# EAGLE design wifiCPUnew (EAGLE 6.3)
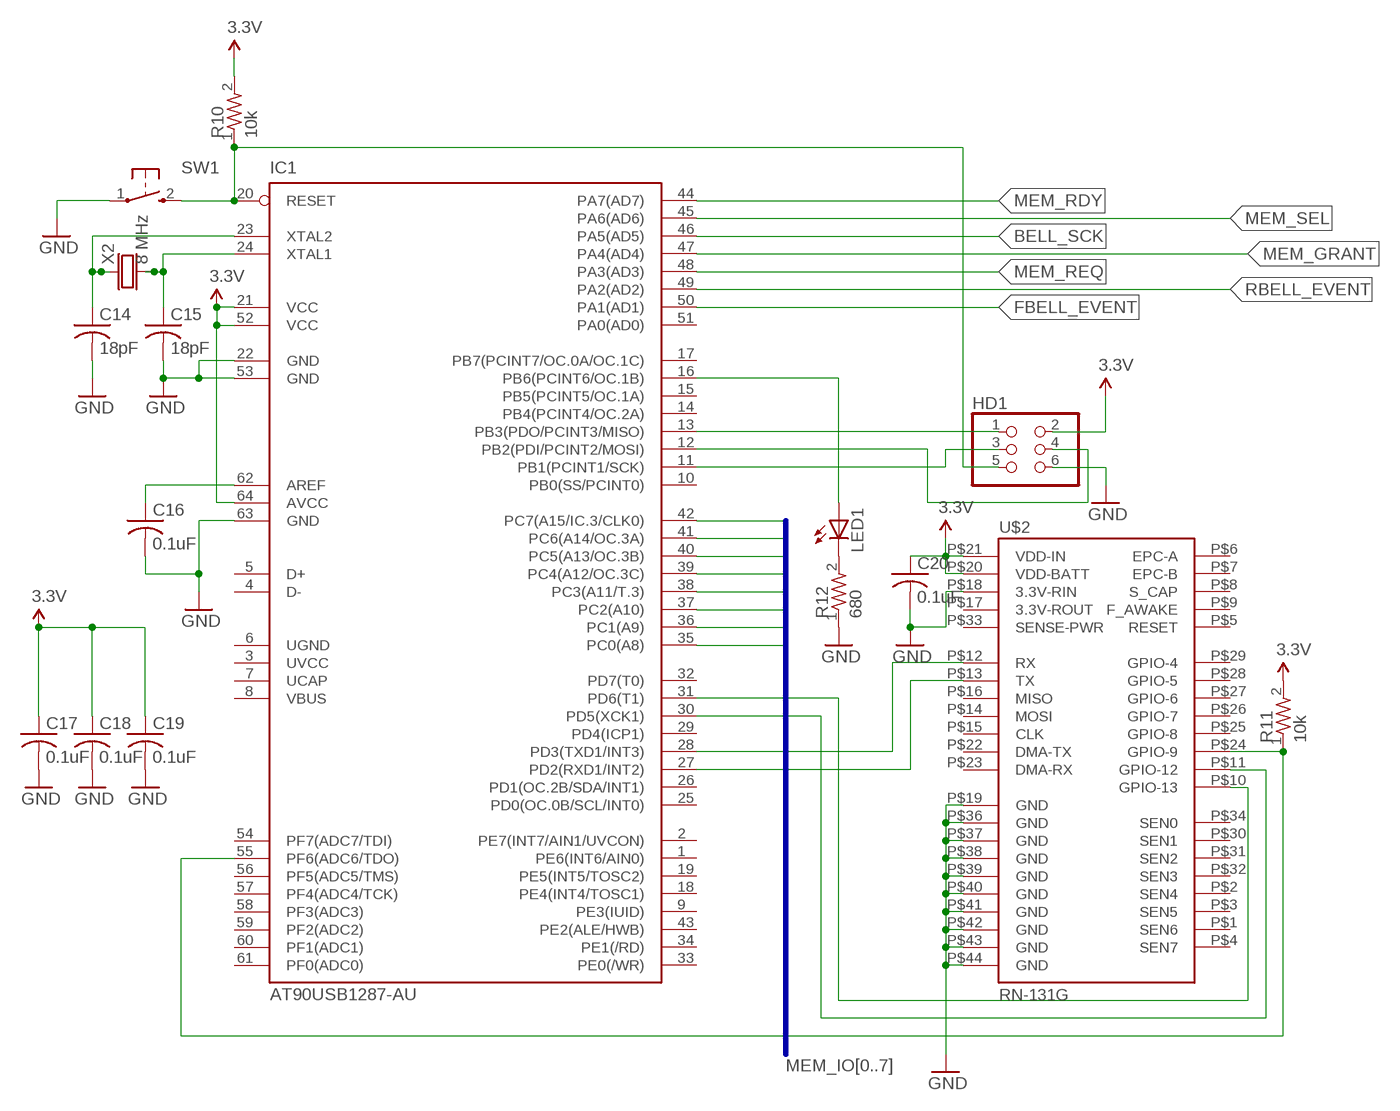
[diagram p0: schematic, sheet 1]

## Parts
C14  18pF  0603_CAP  [0603_RESISTOR]
C15  18pF  0603_CAP  [0603_RESISTOR]
C16  0.1uF  0603_CAP  [0603_RESISTOR]
C17  0.1uF  0603_CAP  [0603_RESISTOR]
C18  0.1uF  0603_CAP  [0603_RESISTOR]
C19  0.1uF  0603_CAP  [0603_RESISTOR]
C20  0.1uF  0603_CAP  [0603_RESISTOR]
HD1  HEADER2X3  [HEADER2X3]
IC1  AT90USB1287-AU  [TQFP64]
LED1  LEDCHIP-LED0603  [CHIP-LED0603]
R10  10k  0603_RESISTOR  [0603_RESISTOR]
R11  10k  0603_RESISTOR  [0603_RESISTOR]
R12  680  0603_RESISTOR  [0603_RESISTOR]
SW1  TAC-SWITCH  [TAC-SWITCH]
U$2  RN-131G  [RN-131G]
X2  8 MHz  CRYSTAL_5X3  [CRYSTAL_5X3]

## Nets
3.3V: C17.1 C18.1 C19.1 C20.1 HD1.2 IC1.21(VCC) IC1.52(VCC) IC1.64(AVCC) R10.2 R11.2 U$2.P$20(VDD-BATT) U$2.P$21(VDD-IN)
BELL_SCK: IC1.46(PA5(AD5))
FBELL_EVENT: IC1.50(PA1(AD1))
GND: C14.2 C15.2 C16.2 C17.2 C18.2 C19.2 C20.2 HD1.6 IC1.22(GND) IC1.53(GND) IC1.63(GND) R12.1 SW1.1 U$2.P$18(3.3V-RIN) U$2.P$19(GND) U$2.P$36(GND) U$2.P$37(GND) U$2.P$38(GND) U$2.P$39(GND) U$2.P$40(GND) U$2.P$41(GND) U$2.P$42(GND) U$2.P$43(GND) U$2.P$44(GND)
MEM_GRANT: IC1.47(PA4(AD4))
MEM_IO0: IC1.35(PC0(A8))
MEM_IO1: IC1.36(PC1(A9))
MEM_IO2: IC1.37(PC2(A10))
MEM_IO3: IC1.38(PC3(A11/T.3))
MEM_IO4: IC1.39(PC4(A12/OC.3C))
MEM_IO5: IC1.40(PC5(A13/OC.3B))
MEM_IO6: IC1.41(PC6(A14/OC.3A))
MEM_IO7: IC1.42(PC7(A15/IC.3/CLK0))
MEM_RDY: IC1.44(PA7(AD7))
MEM_REQ: IC1.48(PA3(AD3))
MEM_SEL: IC1.45(PA6(AD6))
MISO: HD1.1 IC1.13(PB3(PDO/PCINT3/MISO))
MOSI: HD1.4 IC1.12(PB2(PDI/PCINT2/MOSI))
N$1: C14.1 IC1.23(XTAL2) X2.1
N$2: C15.1 IC1.24(XTAL1) X2.2
N$4: LED1.C R12.2
N$5: IC1.16(PB6(PCINT6/OC.1B)) LED1.A
N$6: IC1.28(PD3(TXD1/INT3)) U$2.P$12(RX)
N$8: C16.1 IC1.62(AREF)
N$9: IC1.27(PD2(RXD1/INT2)) U$2.P$13(TX)
N$10: IC1.31(PD6(T1)) U$2.P$10(GPIO-13)
N$11: IC1.30(PD5(XCK1)) U$2.P$11(GPIO-12)
N$13: IC1.55(PF6(ADC6/TDO)) R11.1 U$2.P$24(GPIO-9)
RBELL_EVENT: IC1.49(PA2(AD2))
SCK: HD1.3 IC1.11(PB1(PCINT1/SCK))
WIFI_RESET: HD1.5 IC1.20(RESET) R10.1 SW1.2
Unconnected: IC1.1(PE6(INT6/AIN0)) IC1.2(PE7(INT7/AIN1/UVCON)) IC1.4(D-) IC1.5(D+) IC1.9(PE3(IUID)) IC1.10(PB0(SS/PCINT0)) IC1.14(PB4(PCINT4/OC.2A)) IC1.15(PB5(PCINT5/OC.1A)) IC1.17(PB7(PCINT7/OC.0A/OC.1C)) IC1.18(PE4(INT4/TOSC1)) IC1.19(PE5(INT5/TOSC2)) IC1.25(PD0(OC.0B/SCL/INT0)) IC1.26(PD1(OC.2B/SDA/INT1)) IC1.29(PD4(ICP1)) IC1.32(PD7(T0)) IC1.33(PE0(/WR)) IC1.34(PE1(/RD)) IC1.43(PE2(ALE/HWB)) IC1.51(PA0(AD0)) IC1.54(PF7(ADC7/TDI)) IC1.56(PF5(ADC5/TMS)) IC1.57(PF4(ADC4/TCK)) IC1.58(PF3(ADC3)) IC1.59(PF2(ADC2)) IC1.60(PF1(ADC1)) IC1.61(PF0(ADC0)) U$2.P$1(SEN6) U$2.P$2(SEN4) U$2.P$3(SEN5) U$2.P$4(SEN7) U$2.P$5(RESET) U$2.P$6(EPC-A) U$2.P$7(EPC-B) U$2.P$8(S_CAP) U$2.P$9(F_AWAKE) U$2.P$14(MOSI) U$2.P$15(CLK) U$2.P$16(MISO) U$2.P$17(3.3V-ROUT) U$2.P$22(DMA-TX) U$2.P$23(DMA-RX) U$2.P$25(GPIO-8) U$2.P$26(GPIO-7) U$2.P$27(GPIO-6) U$2.P$28(GPIO-5) U$2.P$29(GPIO-4) U$2.P$30(SEN1) U$2.P$31(SEN2) U$2.P$32(SEN3) U$2.P$33(SENSE-PWR) U$2.P$34(SEN0)

## Buses
MEM_IO[0..7]

## Power pins joined to a net without a drawn wire
UCAP: IC1.7(UCAP)
UGND: IC1.6(UGND)
UVCC: IC1.3(UVCC)
VBUS: IC1.8(VBUS)

## Library data of the parts
C14-C20 = jkf-parts:0603_CAP: 0603 Capacitor
HD1 = jkf-parts:HEADER2X3
IC1 = at90usb:AT90USB1287-*: Atmel AT90USB1287 AVR Microcontroller with USB Interface and 128kB Flash Memory
LED1 = adafruit:LED: LED OSRAM: - CHIPLED LG R971, LG N971, LY N971, LG Q971, LY Q971, LO R971, LY R971 LH N974, LH R974 LS Q976, LO Q976, LY Q976 LO Q996 - Hyper CHIPLED LW Q18S LB Q993, LB Q99A, LB R99A - SideLED LS A670, LO A670, LY A670, LG A670, LP A670 LB A673, LV A673, LT A673, LW A673 LH A674 LY A675 LS A676, LA A676, LO A676, LY A676, LW A676 LS A679, LY A679, LG A679 - Hyper Micro SIDELED® LS Y876, LA Y876, LO Y876, LY Y876 LT Y87S - SmartLED LW L88C, LW L88S LB L89C, LB L89S, LG L890 LS L89K, LO L89K, LY L89K LS L896, LA L896, LO L896, LY L896 - TOPLED LS T670, LO T670, LY T670, LG T670, LP T670 LSG T670, LSP T670, LSY T670, LOP T670, LYG T670 LG T671, LOG T671, LSG T671 LB T673, LV T673, LT T673, LW T673 LH T674 LS T676, LA T676, LO T676, LY T676, LB T676, LH T676, LSB T676, LW T676 LB T67C, LV T67C, LT T67C, LS T67K, LO T67K, LY T67K, LW E67C LS E67B, LA E67B, LO E67B, LY E67B, LB E67C, LV E67C, LT E67C LW T67C LS T679, LY T679, LG T679 LS T770, LO T770, LY T770, LG T770, LP T770 LB T773, LV T773, LT T773, LW T773 LH T774 LS E675, LA E675, LY E675, LS T675 LS T776, LA T776, LO T776, LY T776, LB T776 LHGB T686 LT T68C, LB T68C - Hyper Mini TOPLED® LB M676 - Mini TOPLED Santana® LG M470 LS M47K, LO M47K, LY M47K Source: http://www.osram.convergy.de/
R10-R12 = jkf-parts:0603_RESISTOR
SW1 = jkf-parts:TAC-SWITCH
U$2 = SparkFun-RF:RN-131G: Roving Netowrks WiFLy GSX Module
X2 = jkf-parts:CRYSTAL_5X3: Crystal 5mm x 3mm

## Board
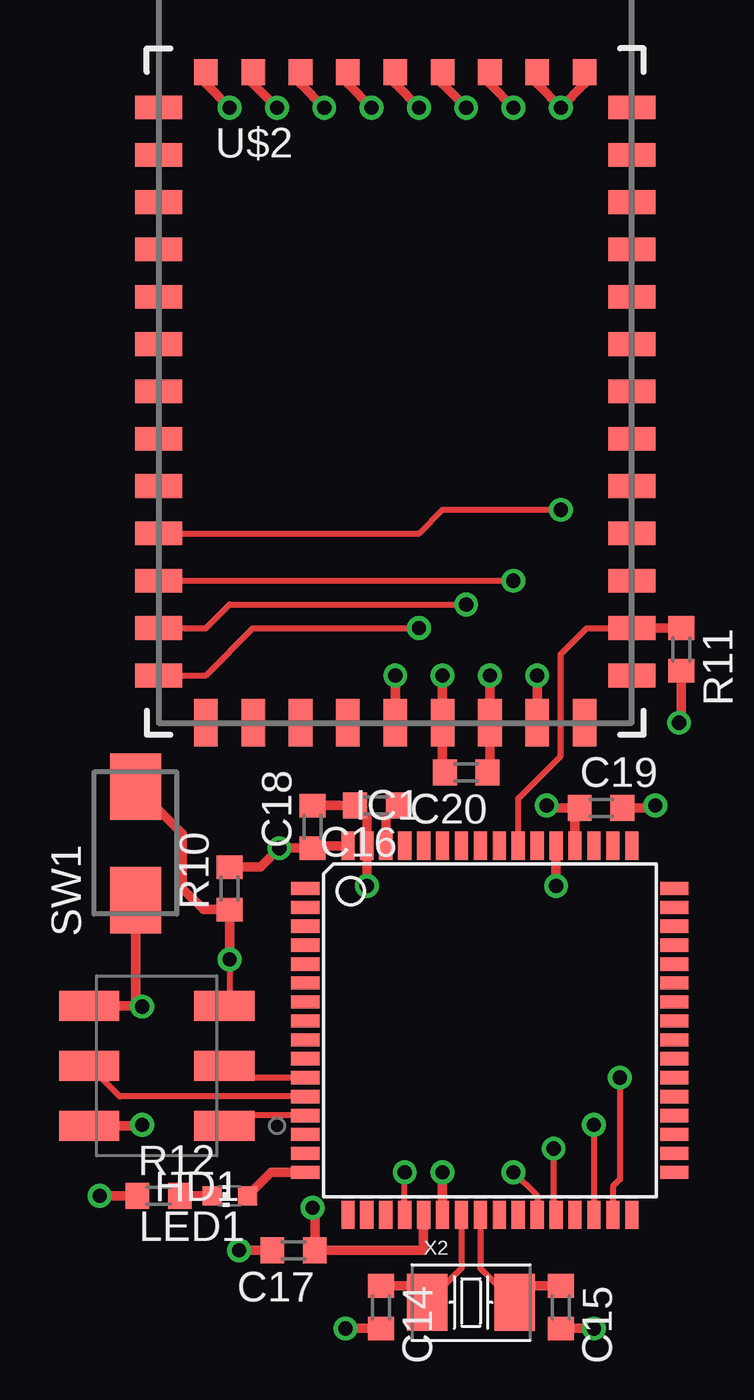
[diagram p1: board, top side]
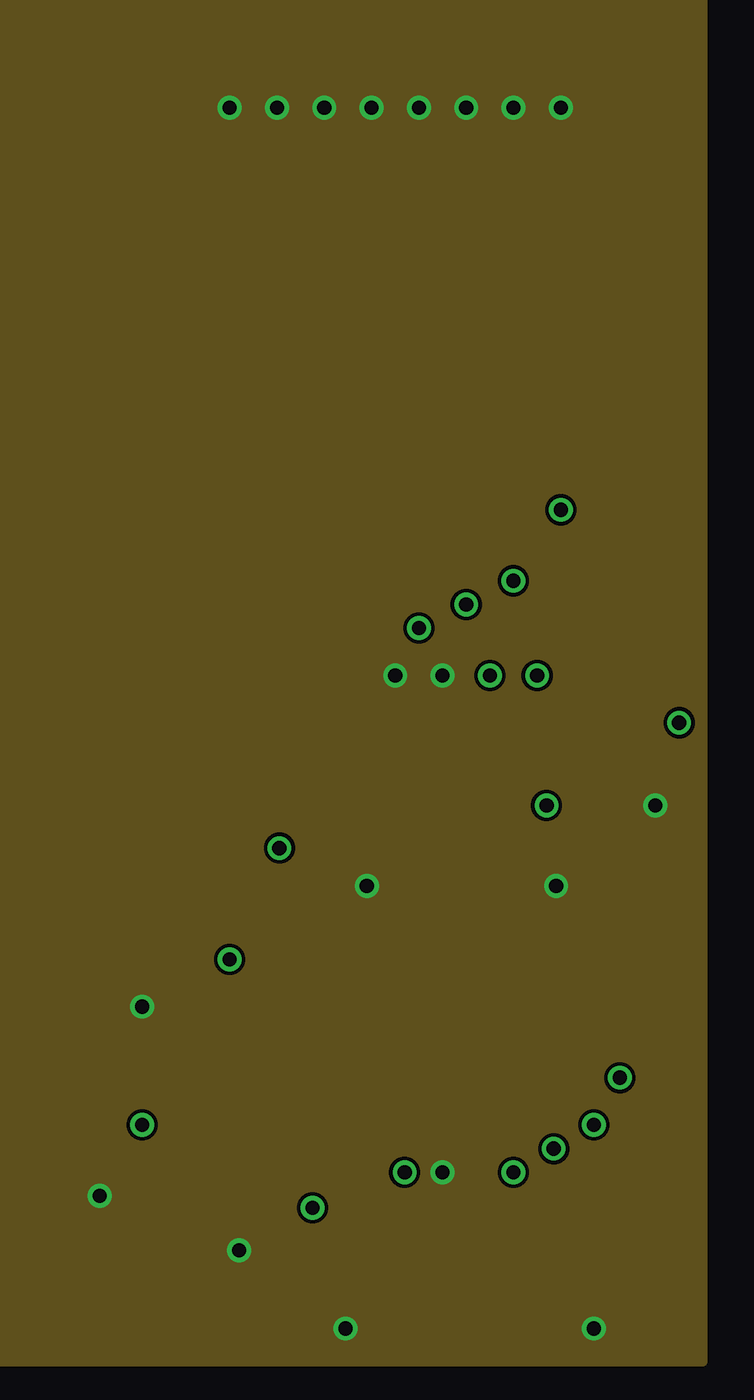
[diagram p2: board, inner layer GND]
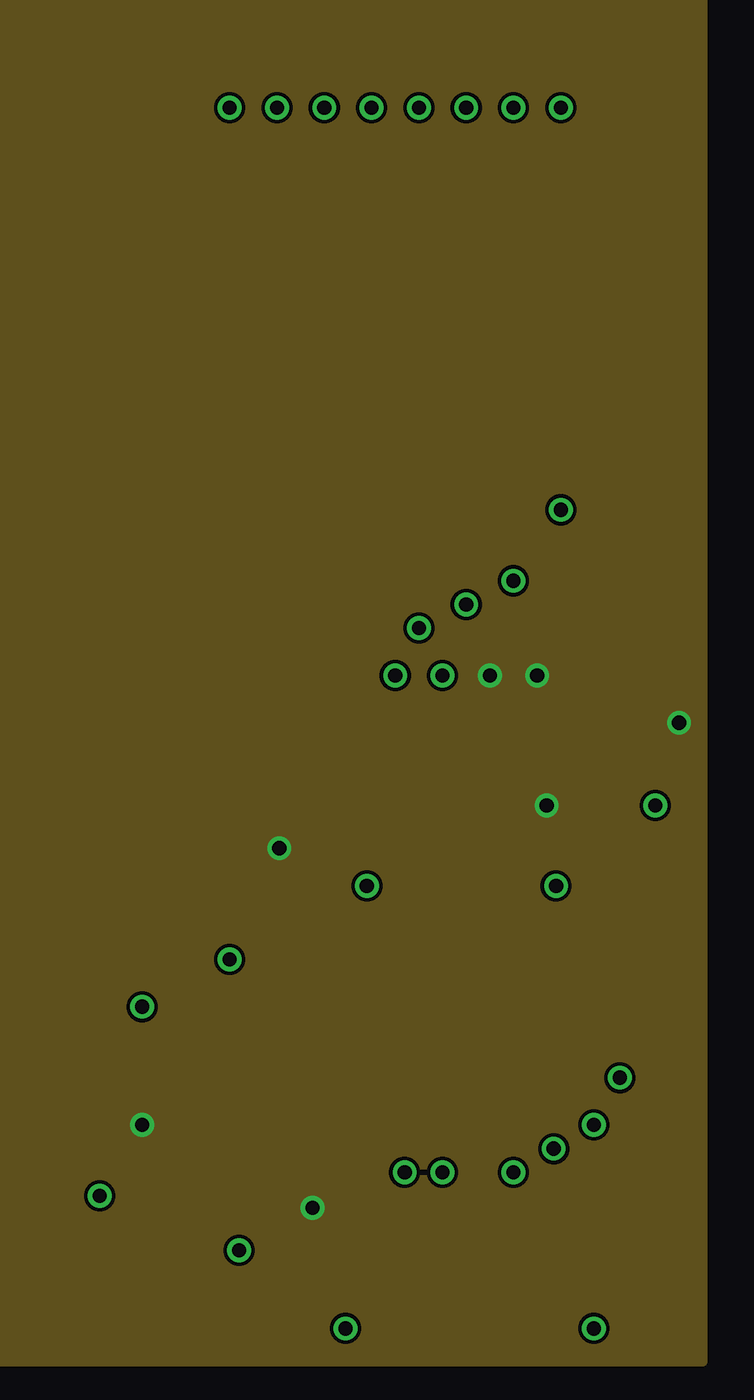
[diagram p3: board, inner layer 3.3V]
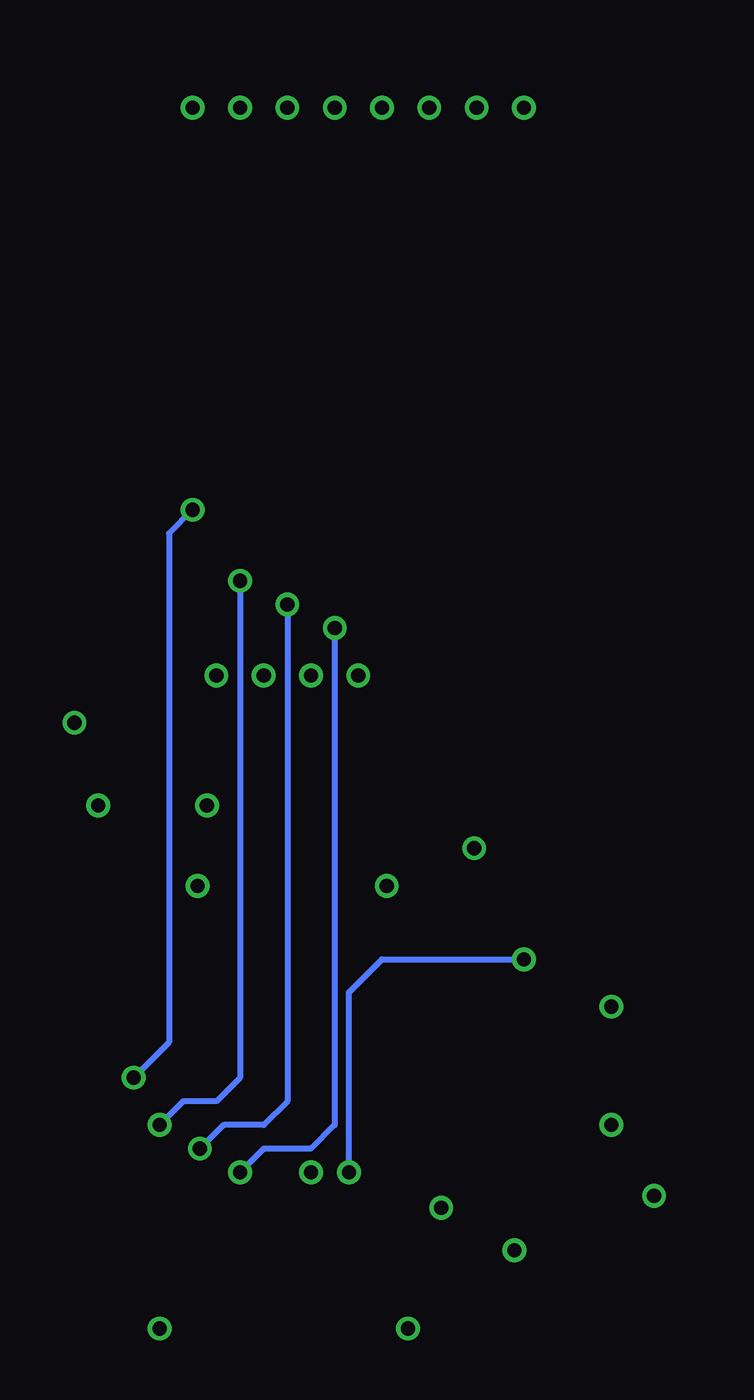
[diagram p4: board, bottom side, seen from below]

No outline drawn. Coordinates in mm, seen from the top.
Copper layers (1+2*15+16): Top 0.0178mm / dielectric 12mil / GND 0.0356mm / dielectric 28mil / 3.3V 0.0356mm / dielectric 12mil / Bottom 0.0178mm
Design rules "SSC-EAGLE-4Lyr_v1.0.0.3": minimum track width 6mil, minimum drill 8mil, track to track 6mil, track to pad 6mil, pad to pad 6mil, via to via 6mil, smd to smd 6mil, copper to edge 20mil, drill to drill 16mil, minimum pad ring 8mil, minimum via ring 8mil, stop-mask expansion 3mil, vias tented up to drill 0mil, thermal gap 10mil
tKeepout: area 10.7,28.7 to 12.3,30.3; area 19.6,33.6 to 21.2,35.2; area 7,56 to 27,64

### Footprints (pad centres in the part's own frame; a part is rotated, then mirrored left to right if it is on the bottom)
0603_RESISTOR = smd 1 x 1.1: 1 -0.9,0; 2 0.9,0
HEADER2X3 = smd 2.54 x 1.27: 1 -3.175,2.54; 2 2.54,2.54; 3 -3.175,0; 4 2.54,0; 5 -3.175,-2.54; 6 2.54,-2.54
TQFP64 = smd 1.194 x 0.559: 1 -7.8,6; 2 -7.8,5.2; 3 -7.8,4.4; 4 -7.8,3.6; 5 -7.8,2.8; 6 -7.8,2; 7 -7.8,1.2; 8 -7.8,0.4; 9 -7.8,-0.4; 10 -7.8,-1.2; 11 -7.8,-2; 12 -7.8,-2.8; 13 -7.8,-3.6; 14 -7.8,-4.4; 15 -7.8,-5.2; 16 -7.8,-6; 33 7.8,-6; 34 7.8,-5.2; 35 7.8,-4.4; 36 7.8,-3.6; 37 7.8,-2.8; 38 7.8,-2; 39 7.8,-1.2; 40 7.8,-0.4; 41 7.8,0.4; 42 7.8,1.2; 43 7.8,2; 44 7.8,2.8; 45 7.8,3.6; 46 7.8,4.4; 47 7.8,5.2; 48 7.8,6 | smd 0.559 x 1.194: 17 -6,-7.8; 18 -5.2,-7.8; 19 -4.4,-7.8; 20 -3.6,-7.8; 21 -2.8,-7.8; 22 -2,-7.8; 23 -1.2,-7.8; 24 -0.4,-7.8; 25 0.4,-7.8; 26 1.2,-7.8; 27 2,-7.8; 28 2.8,-7.8; 29 3.6,-7.8; 30 4.4,-7.8; 31 5.2,-7.8; 32 6,-7.8; 49 6,7.8; 50 5.2,7.8; 51 4.4,7.8; 52 3.6,7.8; 53 2.8,7.8; 54 2,7.8; 55 1.2,7.8; 56 0.4,7.8; 57 -0.4,7.8; 58 -1.2,7.8; 59 -2,7.8; 60 -2.8,7.8; 61 -3.6,7.8; 62 -4.4,7.8; 63 -5.2,7.8; 64 -6,7.8
CHIP-LED0603 = smd 0.8 x 0.8: A 0,-0.75; C 0,0.75
TAC-SWITCH = smd 2.8 x 2.16: 1 1.4,1.08; 2 6.2,1.08
RN-131G = smd 2 x 1: P$1 -10,11; P$2 -10,9; P$3 -10,7; P$4 -10,5; P$5 -10,3; P$6 -10,1; P$7 -10,-1; P$8 -10,-3; P$9 -10,-5; P$10 -10,-7; P$11 -10,-9; P$12 -10,-11; P$13 -10,-13; P$23 10,-13; P$24 10,-11; P$25 10,-9; P$26 10,-7; P$27 10,-5; P$28 10,-3; P$29 10,-1; P$30 10,1; P$31 10,3; P$32 10,5; P$33 10,7; P$34 10,9; P$35 10,11 | smd 1 x 2: P$14 -8,-15; P$15 -6,-15; P$16 -4,-15; P$17 -2,-15; P$18 0,-15; P$19 2,-15; P$20 4,-15; P$21 6,-15; P$22 8,-15 | smd 1 x 1.11: P$36 8,12.492; P$37 6,12.492; P$38 4,12.492; P$39 2,12.492; P$40 0,12.492; P$41 -2,12.492; P$42 -4,12.492; P$43 -6,12.492; P$44 -8,12.492
CRYSTAL_5X3 = smd 1.7 x 2.4: 1 -1.85,0; 2 1.85,0

### Placement (x,y rotation side)
C14  16.4,2.3 270 top
C15  24,2.3 270 top
C16  16.2,23.5 180 top
C17  12.7,4.7 180 top
C18  13.5,22.6 90 top
C19  25.7,23.4 0 top
C20  20,24.9 180 top
HD1  6.6,12.5 180 top
IC1  21,14 0 top
LED1  10,7 90 top
R10  10,20 90 top
R11  29.1,30.1 270 top
R12  7,7 0 top
SW1  7.1,18.1 90 top
U$2  17,42 0 top
X2  20.2,2.5 0 top

### Tracks (layer width: path | path; a pad name or v marks a point on that pad's centre or on a via)
3.3V  (via drill 0.6)
  Top 0.406: C20.1 21,25 U$2.P$20 v21,29 | U$2.P$21 v23,29 | R11.2 29.1,27.1 v29,27 | IC1.52 24.6,23.2 C19.1 23.5,23.4 v23.4,23.5 | IC1.64 13.6,21.8 C18.1 v12.1,21.7 11.3,20.9 R10.2 | HD1.2 6.26,9.96 v6.3,10 | IC1.21 18.2,4.7 C17.1 13.6,6.4 v13.5,6.5
  pour 3.3V: 0,0 30,0 30,65 0,65
GND  (via drill 0.6)
  Top 0.406: U$2.P$44 9,54 v10,53 | U$2.P$43 11,54 v12,53 | U$2.P$42 13,54 v14,53 | U$2.P$41 15,54 v16,53 | U$2.P$40 17,54 v18,53 | U$2.P$39 19,54 v20,53 | U$2.P$38 21,54 v22,53 | U$2.P$37 23,54 v24,53 25,54 U$2.P$36 | v19,29 U$2.P$19 19,25 C20.2 | U$2.P$18 v17,29 | C19.2 27.9,23.4 v28,23.5 | IC1.53 v23.8,20.1 | C18.2 C16.2 15.8,23 IC1.63 v15.8,20.1 | HD1.6 6.26,15.04 v6.3,15 6.02,15.28 SW1.1 | C17.2 v10.4,4.7 | IC1.22 v19,8 | C14.2 v14.9,1.4 | C15.2 v25.4,1.4 | R12.1 v4.5,7
  pour GND: 0,0 30,0 30,65 0,65
MISO
  Top 0.254: IC1.13 10.21,10.4 HD1.1
MOSI
  Top 0.254: IC1.12 5.36,11.2 HD1.4
N$1
  Top 0.254: IC1.23 19.8,3.95 X2.1
  Top 0.406: C14.1 17.65,3.2 X2.1
N$2
  Top 0.254: IC1.24 20.6,3.95 X2.2
  Top 0.406: C15.1 22.75,3.2 X2.2
N$4
  Top 0.406: LED1.C R12.2
N$5
  Top 0.406: IC1.16 11.75,8 LED1.A
N$6  (via drill 0.6)
  Top 0.254: U$2.P$12 9,31 10,32 v20,32 | IC1.28 23.7,6.3 v23.7,9
  Bottom 0.254: v20,32 20,11 21,10 22.7,10 v23.7,9
N$8
  Top 0.406: IC1.62 16.6,23 C16.1
N$9  (via drill 0.6)
  Top 0.254: U$2.P$13 9,29 11,31 v18,31 | v22,8 23,7 IC1.27
  Bottom 0.254: v18,31 18,10 19,9 21,9 v22,8
N$10  (via drill 0.6)
  Top 0.254: U$2.P$10 18,35 19,36 v24,36 | v26.5,12 26.5,7.7 26.2,7.4 IC1.31
  Bottom 0.254: v24,36 25,35 25,13.5 v26.5,12
N$11  (via drill 0.6)
  Top 0.254: U$2.P$11 v22,33 | v25.4,10 IC1.30
  Bottom 0.254: v22,33 22,12 23,11 24.4,11 v25.4,10
N$13
  Top 0.254: IC1.55 22.2,23.8 24,25.6 24,29.9 25.1,31 U$2.P$24
  Top 0.406: R11.1 U$2.P$24
SCK
  Top 0.254: IC1.11 10.28,12 HD1.3
WIFI_RESET  (via drill 0.6)
  Top 0.254: IC1.20 v17.4,8 | v10,17 10,15.27 HD1.5
  Top 0.406: v10,17 R10.1 8.9,19.1 8,20 8,22.32 SW1.2
  Bottom 0.254: v17.4,8 17.4,15.6 16,17 v10,17